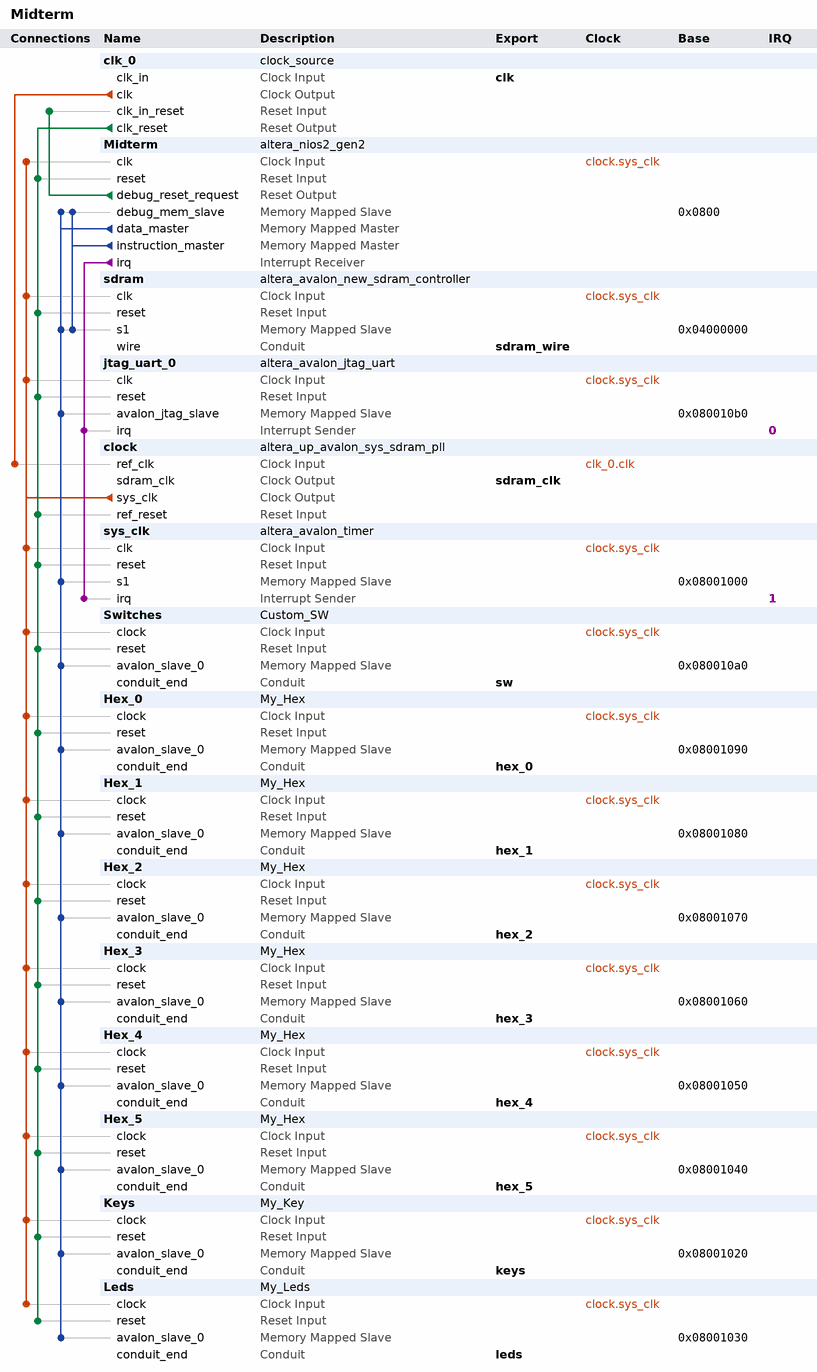
[diagram p0: system contents]
# Platform Designer (Qsys) system Midterm, Cyclone V 5CSEMA5F31C6
# Parameters at their usual value, and those the tool derives, are not listed.
package require -exact qsys 20.1
create_system Midterm
set_project_property DEVICE_FAMILY {Cyclone V}
set_project_property DEVICE 5CSEMA5F31C6

add_instance clk_0 clock_source 20.1
set_instance_parameter_value clk_0 clockFrequency 50000000

add_instance Midterm altera_nios2_gen2 20.1
set_instance_parameter_value Midterm dcache_size 2048
set_instance_parameter_value Midterm exceptionSlave sdram.s1
set_instance_parameter_value Midterm icache_size 4096
set_instance_parameter_value Midterm impl Fast
set_instance_parameter_value Midterm resetSlave sdram.s1

add_instance sdram altera_avalon_new_sdram_controller 20.1
set_instance_parameter_value sdram TAC 5.4
set_instance_parameter_value sdram TRCD 20.0
set_instance_parameter_value sdram TRFC 15.0
set_instance_parameter_value sdram TRP 15.0
set_instance_parameter_value sdram casLatency 3
set_instance_parameter_value sdram columnWidth 10
set_instance_parameter_value sdram dataWidth 16
set_instance_parameter_value sdram generateSimulationModel false
set_instance_parameter_value sdram model single_Micron_MT48LC4M32B2_7_chip
set_instance_parameter_value sdram numberOfBanks 4
set_instance_parameter_value sdram numberOfChipSelects 1
set_instance_parameter_value sdram powerUpDelay 100.0
set_instance_parameter_value sdram refreshPeriod 7.8125
set_instance_parameter_value sdram rowWidth 13

add_instance jtag_uart_0 altera_avalon_jtag_uart 20.1
set_instance_parameter_value jtag_uart_0 simInteractiveOptions NO_INTERACTIVE_WINDOWS

add_instance clock altera_up_avalon_sys_sdram_pll 18.0
set_instance_parameter_value clock CV_boards DE1-SoC
set_instance_parameter_value clock gui_outclk 50.0
set_instance_parameter_value clock gui_refclk 50.0

add_instance sys_clk altera_avalon_timer 20.1
set_instance_parameter_value sys_clk period 1
set_instance_parameter_value sys_clk periodUnits MSEC

add_instance Switches Custom_SW 1.0

add_instance Hex_0 My_Hex 1.0

add_instance Hex_1 My_Hex 1.0

add_instance Hex_2 My_Hex 1.0

add_instance Hex_3 My_Hex 1.0

add_instance Hex_4 My_Hex 1.0

add_instance Hex_5 My_Hex 1.0

add_instance Keys My_Key 1.0

add_instance Leds My_Leds 1.0

# connections
add_connection clk_0.clk clock.ref_clk clock
add_connection clock.sys_clk Hex_0.clock clock
add_connection clock.sys_clk Hex_1.clock clock
add_connection clock.sys_clk Hex_2.clock clock
add_connection clock.sys_clk Hex_3.clock clock
add_connection clock.sys_clk Hex_4.clock clock
add_connection clock.sys_clk Hex_5.clock clock
add_connection clock.sys_clk jtag_uart_0.clk clock
add_connection clock.sys_clk Keys.clock clock
add_connection clock.sys_clk Leds.clock clock
add_connection clock.sys_clk Midterm.clk clock
add_connection clock.sys_clk sdram.clk clock
add_connection clock.sys_clk Switches.clock clock
add_connection clock.sys_clk sys_clk.clk clock
add_connection clk_0.clk_reset clock.ref_reset reset
add_connection clk_0.clk_reset Hex_0.reset reset
add_connection clk_0.clk_reset Hex_1.reset reset
add_connection clk_0.clk_reset Hex_2.reset reset
add_connection clk_0.clk_reset Hex_3.reset reset
add_connection clk_0.clk_reset Hex_4.reset reset
add_connection clk_0.clk_reset Hex_5.reset reset
add_connection clk_0.clk_reset jtag_uart_0.reset reset
add_connection clk_0.clk_reset Keys.reset reset
add_connection clk_0.clk_reset Leds.reset reset
add_connection clk_0.clk_reset Midterm.reset reset
add_connection clk_0.clk_reset sdram.reset reset
add_connection clk_0.clk_reset Switches.reset reset
add_connection clk_0.clk_reset sys_clk.reset reset
add_connection Midterm.debug_reset_request clk_0.clk_in_reset reset
add_connection Midterm.data_master Hex_0.avalon_slave_0 avalon
set_connection_parameter_value Midterm.data_master/Hex_0.avalon_slave_0 baseAddress 0x08001090
add_connection Midterm.data_master Hex_1.avalon_slave_0 avalon
set_connection_parameter_value Midterm.data_master/Hex_1.avalon_slave_0 baseAddress 0x08001080
add_connection Midterm.data_master Hex_2.avalon_slave_0 avalon
set_connection_parameter_value Midterm.data_master/Hex_2.avalon_slave_0 baseAddress 0x08001070
add_connection Midterm.data_master Hex_3.avalon_slave_0 avalon
set_connection_parameter_value Midterm.data_master/Hex_3.avalon_slave_0 baseAddress 0x08001060
add_connection Midterm.data_master Hex_4.avalon_slave_0 avalon
set_connection_parameter_value Midterm.data_master/Hex_4.avalon_slave_0 baseAddress 0x08001050
add_connection Midterm.data_master Hex_5.avalon_slave_0 avalon
set_connection_parameter_value Midterm.data_master/Hex_5.avalon_slave_0 baseAddress 0x08001040
add_connection Midterm.data_master jtag_uart_0.avalon_jtag_slave avalon
set_connection_parameter_value Midterm.data_master/jtag_uart_0.avalon_jtag_slave baseAddress 0x080010b0
add_connection Midterm.data_master Keys.avalon_slave_0 avalon
set_connection_parameter_value Midterm.data_master/Keys.avalon_slave_0 baseAddress 0x08001020
add_connection Midterm.data_master Leds.avalon_slave_0 avalon
set_connection_parameter_value Midterm.data_master/Leds.avalon_slave_0 baseAddress 0x08001030
add_connection Midterm.data_master Midterm.debug_mem_slave avalon
set_connection_parameter_value Midterm.data_master/Midterm.debug_mem_slave baseAddress 0x0800
add_connection Midterm.data_master sdram.s1 avalon
set_connection_parameter_value Midterm.data_master/sdram.s1 baseAddress 0x04000000
add_connection Midterm.data_master Switches.avalon_slave_0 avalon
set_connection_parameter_value Midterm.data_master/Switches.avalon_slave_0 baseAddress 0x080010a0
add_connection Midterm.data_master sys_clk.s1 avalon
set_connection_parameter_value Midterm.data_master/sys_clk.s1 baseAddress 0x08001000
add_connection Midterm.instruction_master Midterm.debug_mem_slave avalon
set_connection_parameter_value Midterm.instruction_master/Midterm.debug_mem_slave baseAddress 0x0800
add_connection Midterm.instruction_master sdram.s1 avalon
set_connection_parameter_value Midterm.instruction_master/sdram.s1 baseAddress 0x04000000
add_connection Midterm.irq jtag_uart_0.irq interrupt
set_connection_parameter_value Midterm.irq/jtag_uart_0.irq irqNumber 0
add_connection Midterm.irq sys_clk.irq interrupt
set_connection_parameter_value Midterm.irq/sys_clk.irq irqNumber 1

# exported interfaces
add_interface clk clock sink
set_interface_property clk EXPORT_OF clk_0.clk_in
add_interface hex_0 conduit end
set_interface_property hex_0 EXPORT_OF Hex_0.conduit_end
add_interface hex_1 conduit end
set_interface_property hex_1 EXPORT_OF Hex_1.conduit_end
add_interface hex_2 conduit end
set_interface_property hex_2 EXPORT_OF Hex_2.conduit_end
add_interface hex_3 conduit end
set_interface_property hex_3 EXPORT_OF Hex_3.conduit_end
add_interface hex_4 conduit end
set_interface_property hex_4 EXPORT_OF Hex_4.conduit_end
add_interface hex_5 conduit end
set_interface_property hex_5 EXPORT_OF Hex_5.conduit_end
add_interface keys conduit end
set_interface_property keys EXPORT_OF Keys.conduit_end
add_interface leds conduit end
set_interface_property leds EXPORT_OF Leds.conduit_end
add_interface sdram_clk clock source
set_interface_property sdram_clk EXPORT_OF clock.sdram_clk
add_interface sdram_wire conduit end
set_interface_property sdram_wire EXPORT_OF sdram.wire
add_interface sw conduit end
set_interface_property sw EXPORT_OF Switches.conduit_end

set_interconnect_requirement {$system} qsys_mm.clockCrossingAdapter HANDSHAKE
set_interconnect_requirement {$system} qsys_mm.enableEccProtection FALSE
set_interconnect_requirement {$system} qsys_mm.insertDefaultSlave FALSE
set_interconnect_requirement {$system} qsys_mm.maxAdditionalLatency 1

save_system Midterm.qsys
